# EAGLE schematic ajuste-sensor-temperatura2 (EAGLE 8.1.1)
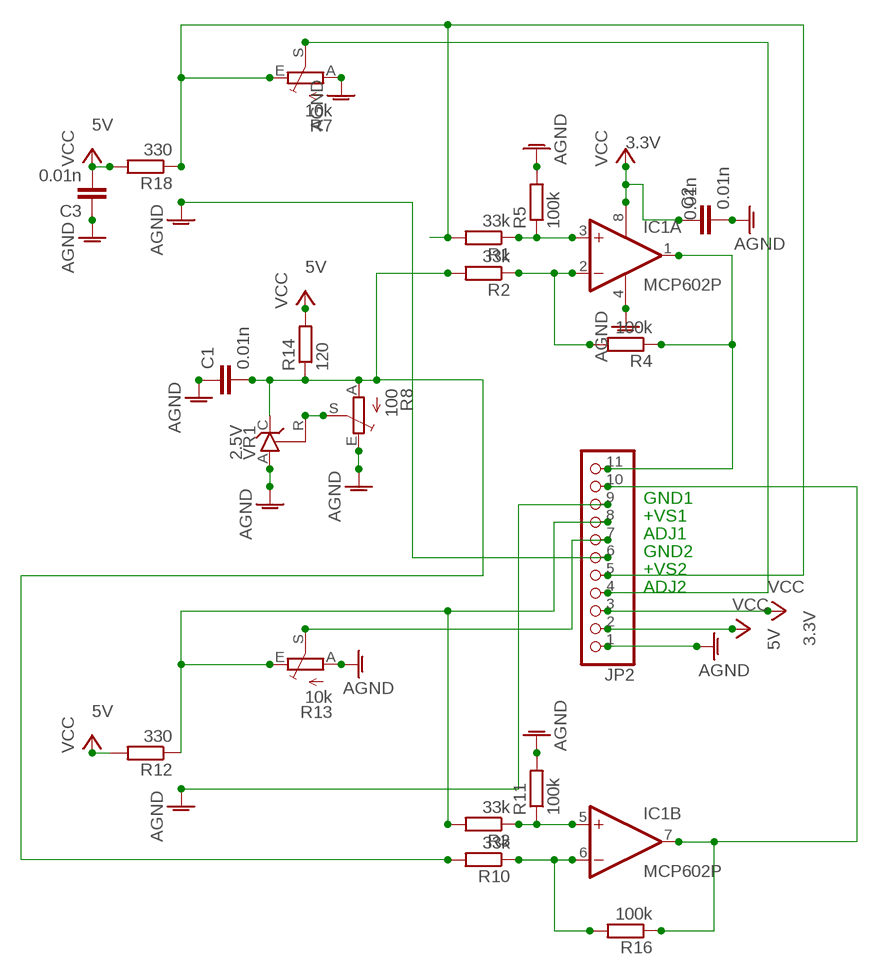
[diagram p0: schematic, sheet 1]

## Parts
C1  0.01n  C7.5/3  [C7.5B3]
C2  0.01n  C7.5/3  [C7.5B3]
C3  0.01n  C7.5/3  [C7.5B3]
IC1  MCP602P  [DIL08]
JP2  PINHD-1X11  [1X11]
R1  33k  R-EU_0204/7  [0204/7]
R2  33k  R-EU_0204/7  [0204/7]
R3  33k  R-EU_0204/7  [0204/7]
R4  100k  R-EU_0204/7  [0204/7]
R5  100k  R-EU_0204/7  [0204/7]
R7  10k  TRIM_EU-CA9V  [CA9V]
R8  100  TRIM_EU-CA9V  [CA9V]
R10  33k  R-EU_0204/7  [0204/7]
R11  100k  R-EU_0204/7  [0204/7]
R12  330  R-EU_0204/7  [0204/7]
R13  10k  TRIM_EU-CA9V  [CA9V]
R14  120  R-EU_0204/7  [0204/7]
R16  100k  R-EU_0204/7  [0204/7]
R18  330  R-EU_0204/7  [0204/7]
VR1  2.5V  TL431CLP  [TO92-CLP]

## Nets
AGND: C1.1 C2.2 C3.1 IC1.4(P:V-) JP2.1 JP2.6 JP2.9 R5.2 R7.A R8.E R11.2 R13.A VR1.A
N$1: IC1.3(A:+IN) R1.1 R5.1
N$2: IC1.2(A:-IN) R2.1 R4.2
N$4: JP2.5 R1.2 R7.E R18.1
N$5: JP2.4 R7.S
N$6: R8.S VR1.R
N$8: IC1.5(B:+IN) R3.1 R11.1
N$9: IC1.6(B:-IN) R10.1 R16.2
N$10: JP2.8 R3.2 R12.1 R13.E
N$11: JP2.7 R13.S
N$13: C1.2 R2.2 R8.A R10.2 R14.1 VR1.C
OUT$1: IC1.1(A:OUT) JP2.11 R4.1
OUT$2: IC1.7(B:OUT) JP2.10 R16.1
VCC: C2.1 C3.2 IC1.8(P:V+) JP2.2 JP2.3 R12.2 R14.2 R18.2

## Notes on the sheet
- GND1
- +VS1
- ADJ1
- GND2
- +VS2
- ADJ2

## Library data of the parts
C1 C3 = capacitor-wima:C: CAPACITOR naming: grid - package width
C2 = capacitor-wima:C: CAPACITOR naming: grid - package width; C1: 0.01n
IC1 = linear:MCP602: Single Op Amp 2.7V to 6.0V Single Supply CMOS Source: http://ww1.microchip.com/downloads/en/DeviceDoc/21314g.pdf
JP2 = pinhead:PINHD-1X11: PIN HEADER
R1-R5 R10-R12 R14 R16 R18 = resistor:R-EU_: RESISTOR, European symbol
R7 R8 R13 = pot:TRIM_EU-: POTENTIOMETER
VR1 = v-reg:TL431CLP: VOLTAGE REGULATOR